# EAGLE design MONITOR_final_rev01 (EAGLE 9.6.0)
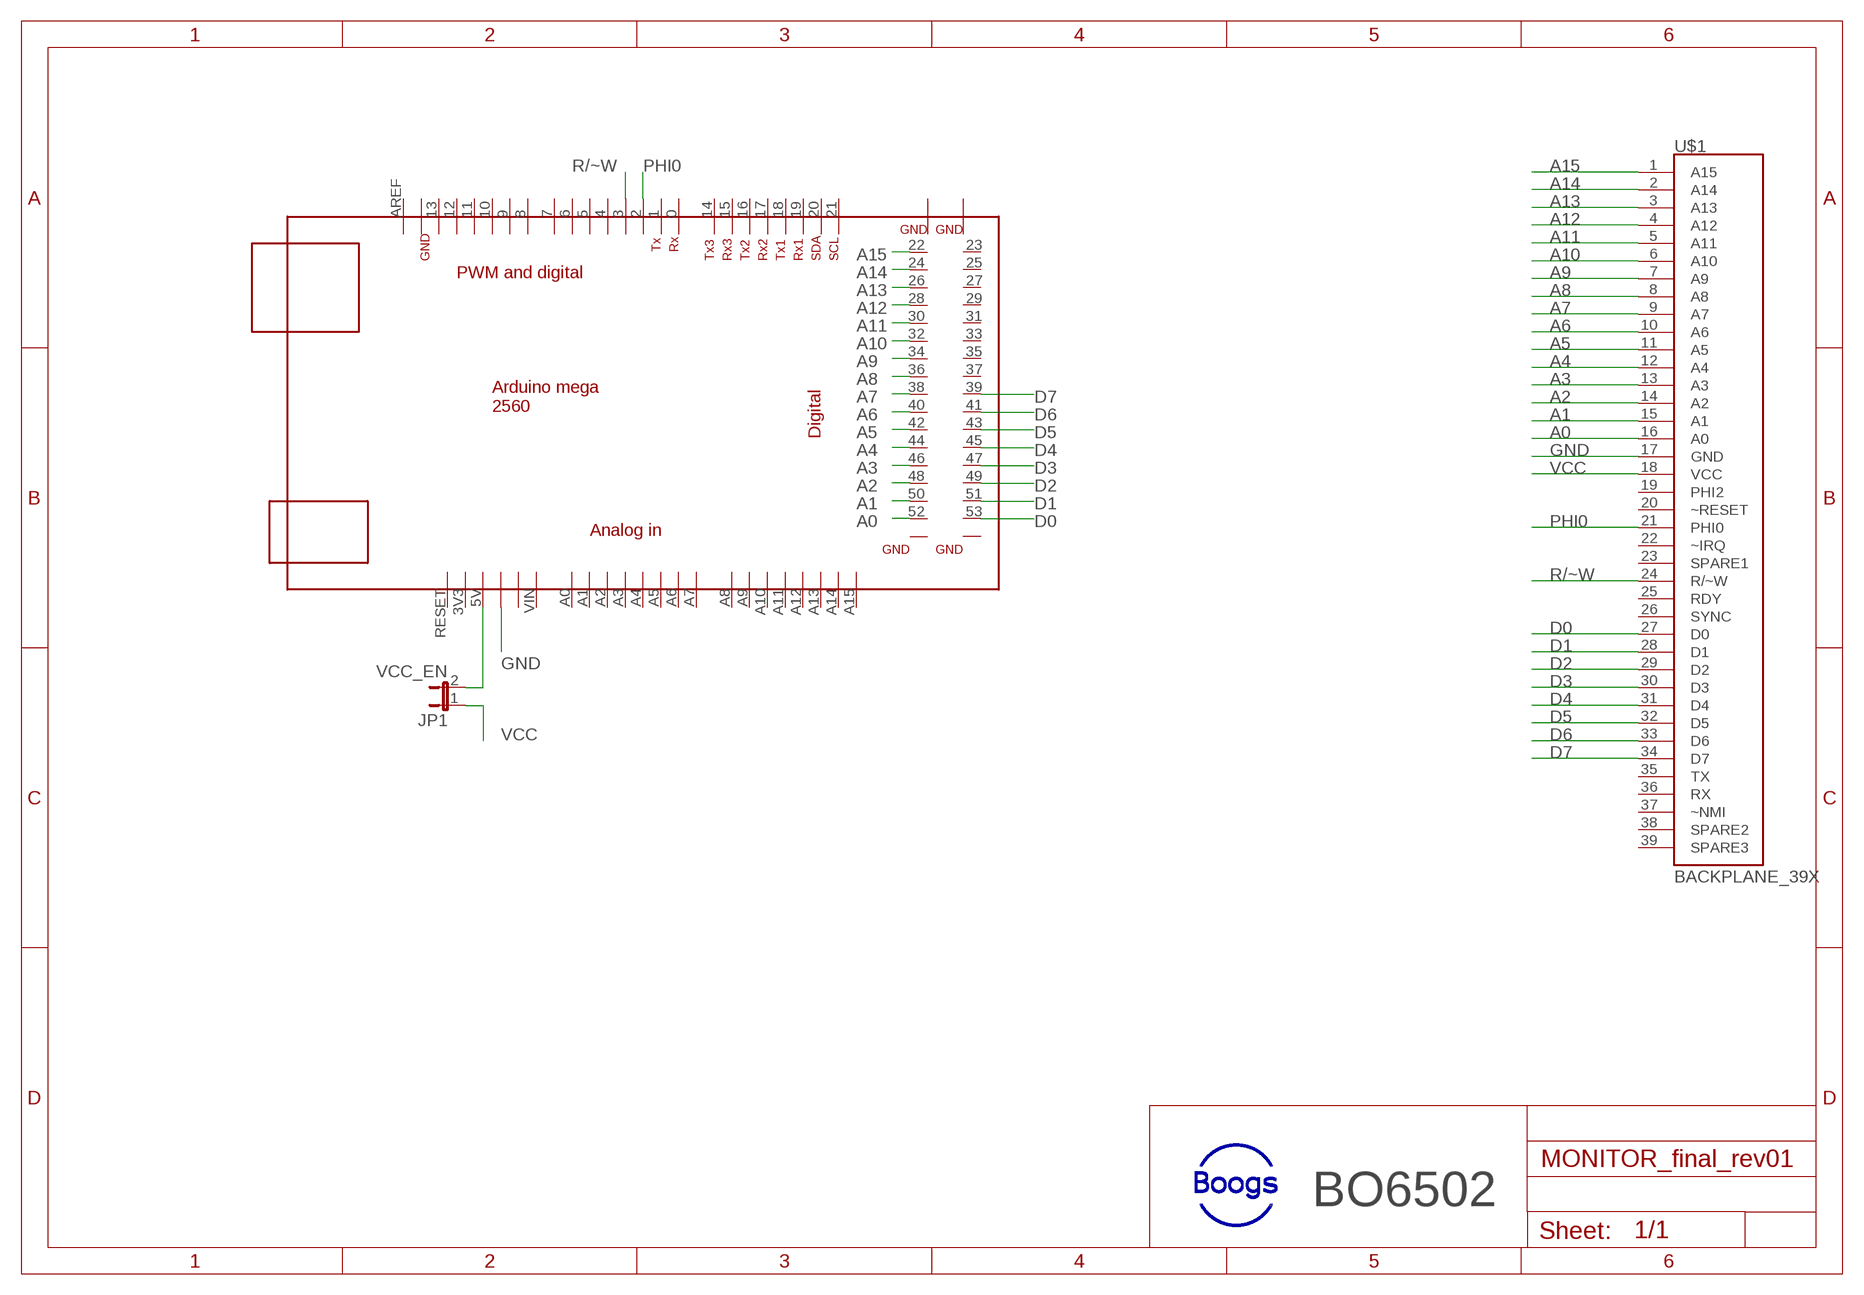
[diagram p0: schematic, sheet 1]

## Parts
JP1  VCC_EN  JP1E  [JP1]
U$1  BACKPLANE_39X  [BP_39X]
U$2  MEGA_DEVICE  [MEGAOUTLINE]

## Nets
A0: U$1.16(A0) U$2.52
A1: U$1.15(A1) U$2.50
A2: U$1.14(A2) U$2.48
A3: U$1.13(A3) U$2.46
A4: U$1.12(A4) U$2.44
A5: U$1.11(A5) U$2.42
A6: U$1.10(A6) U$2.40
A7: U$1.9(A7) U$2.38
A8: U$1.8(A8) U$2.36
A9: U$1.7(A9) U$2.34
A10: U$1.6(A10) U$2.32
A11: U$1.5(A11) U$2.30
A12: U$1.4(A12) U$2.28
A13: U$1.3(A13) U$2.26
A14: U$1.2(A14) U$2.24
A15: U$1.1(A15) U$2.22
D0: U$1.27(D0) U$2.53
D1: U$1.28(D1) U$2.51
D2: U$1.29(D2) U$2.49
D3: U$1.30(D3) U$2.47
D4: U$1.31(D4) U$2.45
D5: U$1.32(D5) U$2.43
D6: U$1.33(D6) U$2.41
D7: U$1.34(D7) U$2.39
GND: U$1.17(GND) U$2.GND@2(GND)
N$1: JP1.2 U$2.5V
PHI0: U$1.21(PHI0) U$2.2
R/~W: U$1.24(R/~W) U$2.3
VCC: JP1.1 U$1.18(VCC)
Unconnected: U$1.19(PHI2) U$1.20(~RESET) U$1.22(~IRQ) U$1.23(SPARE1) U$1.25(RDY) U$1.26(SYNC) U$1.35(TX) U$1.36(RX) U$1.37(~NMI) U$1.38(SPARE2) U$1.39(SPARE3) U$2.0 U$2.1 U$2.3V3 U$2.4 U$2.5 U$2.6 U$2.7 U$2.8 U$2.9 U$2.10 U$2.11 U$2.12 U$2.13 U$2.14 U$2.15 U$2.16 U$2.17 U$2.18 U$2.19 U$2.20 U$2.21 U$2.23 U$2.25 U$2.27 U$2.29 U$2.31 U$2.33 U$2.35 U$2.37 U$2.A0 U$2.A1 U$2.A2 U$2.A3 U$2.A4 U$2.A5 U$2.A6 U$2.A7 U$2.A8 U$2.A9 U$2.A10 U$2.A11 U$2.A12 U$2.A13 U$2.A14 U$2.A15 U$2.AREF U$2.GND@1(GND) U$2.GND@3(GND) U$2.GND@4(GND) U$2.GND@5(GND) U$2.GND@6(GND) U$2.GND@7(GND) U$2.RESET U$2.VIN

## Notes on the sheet
- BO6502

## Library data of the parts
JP1 = jumper:JP1E: JUMPER
U$1 = 65xx_family:BACKPLANE_39X; A15: A15
U$2 = ArduinoMegaOutline:MEGA_DEVICE: mega card as device

## Board
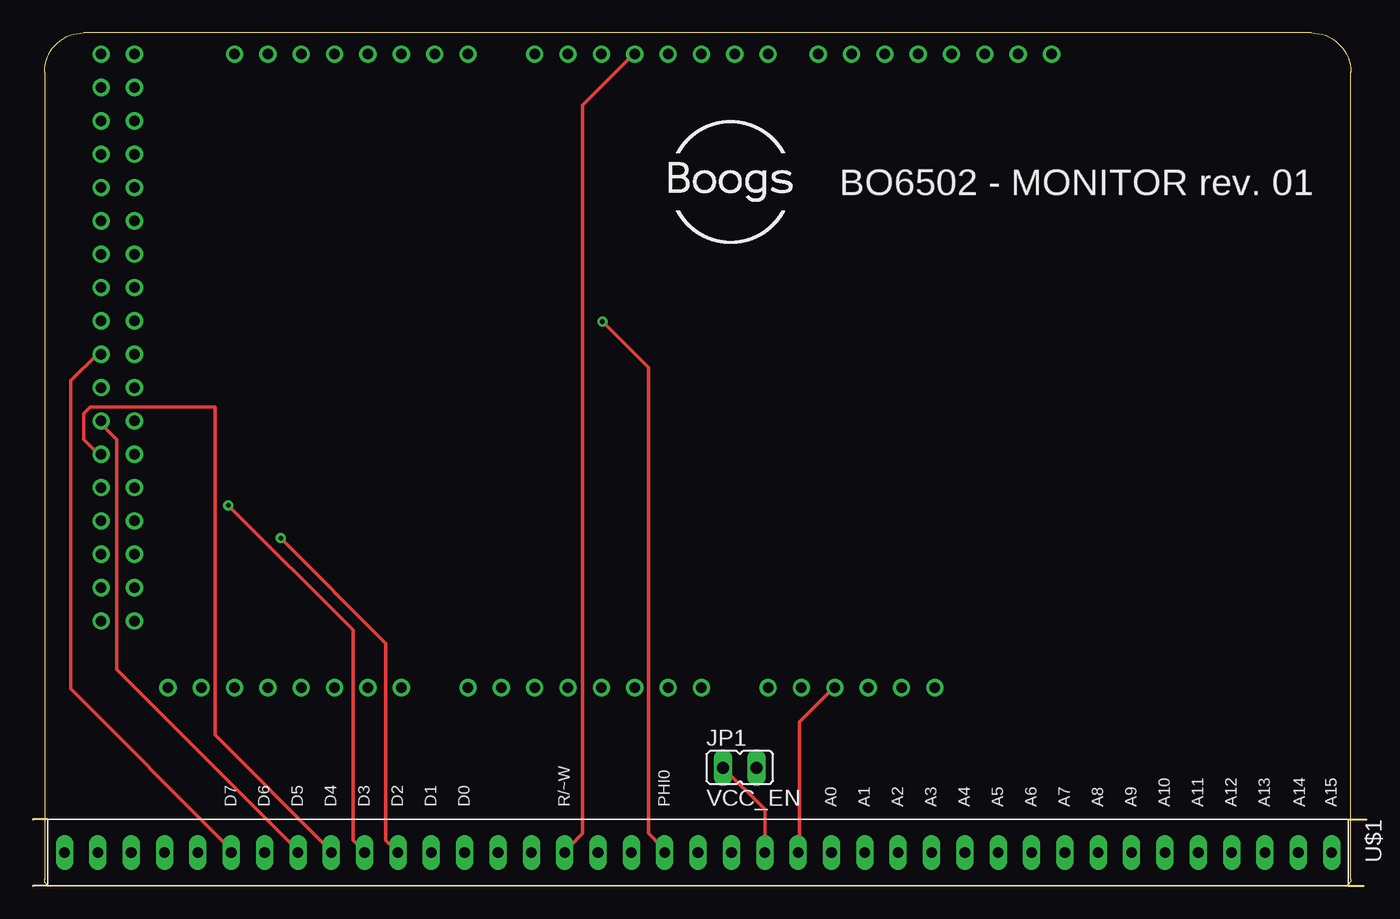
[diagram p1: board, top side]
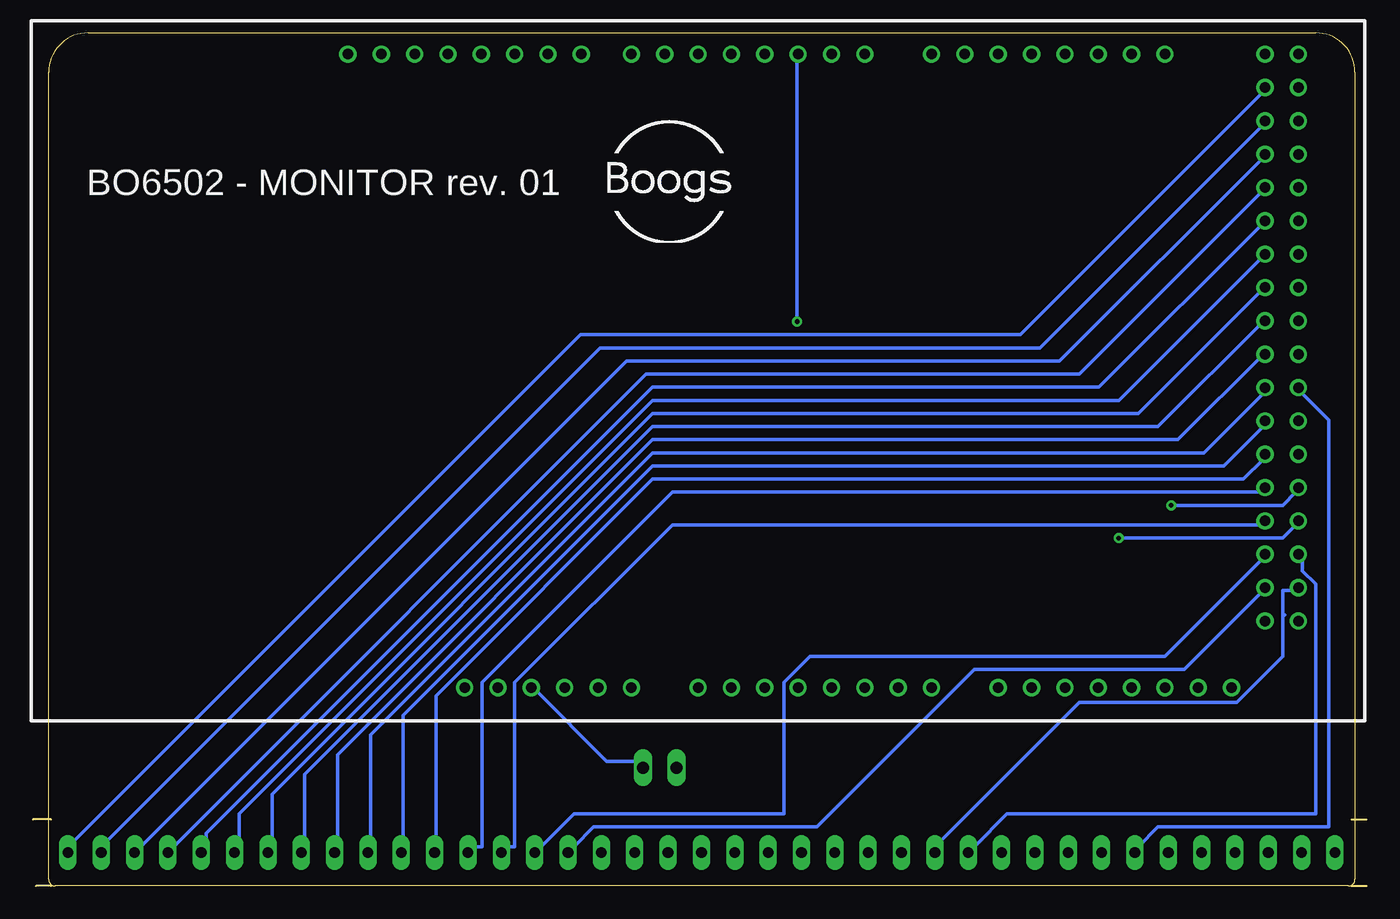
[diagram p2: board, bottom side, seen from below]

Size 101.6 x 65 mm. Coordinates in mm from the lower left corner, seen from the top.
Outline: 1.14,5.08 0,5.08
Outline: 1.14,0 0,0
Outline: 100.2,5.08 101.6,5.08
Outline: 100.2,0 101.35,0
Outline: 1.39,0 99.89,0 arc90 100.39,0.5 100.39,62 arc90 97.39,65 3.89,65 arc90 0.89,62 0.89,0.5 arc90 1.39,0
Copper layers (1*16): Top 0.035mm / dielectric 1.5mm / Bottom 0.035mm
Design rules "default *": minimum track width 10mil, minimum drill 0.35mm, track to track 10mil, track to pad 10mil, pad to pad 10mil, via to via 10mil, smd to smd 6mil, copper to edge 40mil, drill to drill 6mil, minimum pad ring 10mil, minimum via ring 8mil, stop-mask expansion 4mil, vias tented up to drill 15mil, thermal gap 10mil

### Footprints (pad centres in the part's own frame; a part is rotated, then mirrored left to right if it is on the bottom)
JP1 = drill 0.914 long: 1 0,-1.27; 2 0,1.27
BP_39X = drill 0.813 long: 1 1.27,59.69; 2 1.27,57.15; 3 1.27,54.61; 4 1.27,52.07; 5 1.27,49.53; 6 1.27,46.99; 7 1.27,44.45; 8 1.27,41.91; 9 1.27,39.37; 10 1.27,36.83; 11 1.27,34.29; 12 1.27,31.75; 13 1.27,29.21; 14 1.27,26.67; 15 1.27,24.13; 16 1.27,21.59; 17 1.27,19.05; 18 1.27,16.51; 19 1.27,13.97; 20 1.27,11.43; 21 1.27,8.89; 22 1.27,6.35; 23 1.27,3.81; 24 1.27,1.27; 25 1.27,-1.27; 26 1.27,-3.81; 27 1.27,-6.35; 28 1.27,-8.89; 29 1.27,-11.43; 30 1.27,-13.97; 31 1.27,-16.51; 32 1.27,-19.05; 33 1.27,-21.59; 34 1.27,-24.13; 35 1.27,-26.67; 36 1.27,-29.21; 37 1.27,-31.75; 38 1.27,-34.29; 39 1.27,-36.83
MEGAOUTLINE = drill 0.8: 0 12.7,24.13; 1 10.16,24.13; 2 7.62,24.13; 3 5.08,24.13; 3V3 -15.24,-24.13; 4 2.54,24.13; 5 0,24.13; 5V -12.7,-24.13; 6 -2.54,24.13; 7 -5.08,24.13; 8 -8.89,24.13; 9 -11.43,24.13; 10 -13.97,24.13; 11 -16.51,24.13; 12 -19.05,24.13; 13 -21.59,24.13; 14 17.78,24.13; 15 20.32,24.13; 16 22.86,24.13; 17 25.4,24.13; 18 27.94,24.13; 19 30.48,24.13; 20 33.02,24.13; 21 35.56,24.13; 22 43.18,21.59; 23 45.72,21.59; 24 43.18,19.05; 25 45.72,19.05; 26 43.18,16.51; 27 45.72,16.51; 28 43.18,13.97; 29 45.72,13.97; 30 43.18,11.43; 31 45.72,11.43; 32 43.18,8.89; 33 45.72,8.89; 34 43.18,6.35; 35 45.72,6.35; 36 43.18,3.81; 37 45.72,3.81; 38 43.18,1.27; 39 45.72,1.27; 40 43.18,-1.27; 41 45.72,-1.27; 42 43.18,-3.81; 43 45.72,-3.81; 44 43.18,-6.35; 45 45.72,-6.35; 46 43.18,-8.89; 47 45.72,-8.89; 48 43.18,-11.43; 49 45.72,-11.43; 50 43.18,-13.97; 51 45.72,-13.97; 52 43.18,-16.51; 53 45.72,-16.51; A0 0,-24.13; A1 2.54,-24.13; A2 5.08,-24.13; A3 7.62,-24.13; A4 10.16,-24.13; A5 12.7,-24.13; A6 15.24,-24.13; A7 17.78,-24.13; A8 22.86,-24.13; A9 25.4,-24.13; A10 27.94,-24.13; A11 30.48,-24.13; A12 33.02,-24.13; A13 35.56,-24.13; A14 38.1,-24.13; A15 40.64,-24.13; AREF -26.67,24.13; GND@1 -24.13,24.13; GND@2 -10.16,-24.13; GND@3 -7.62,-24.13; GND@4 43.18,24.13; GND@5 45.72,24.13; GND@6 43.18,-19.05; GND@7 45.72,-19.05; RESET -17.78,-24.13; VIN -5.08,-24.13

### Placement (x,y rotation side)
JP1  53.85,9.02 270 top
U$1  39.24,3.81 270 top
U$2  50.93,39.24 0 bottom

### Tracks (layer width: path | path; a pad name or v marks a point on that pad's centre or on a via)
A0
  Bottom 0.254: U$2.52 7.89,22.5 13.89,16.5 29.89,16.5 41.89,4.5 58.89,4.5 60.39,3 U$1.16
A1
  Bottom 0.254: U$2.50 7.89,25 15.39,17.5 42.39,17.5 44.39,15.5 44.39,5.5 60.39,5.5 62.89,3 U$1.15
A2
  Bottom 0.254: U$2.48 7.89,27.5 52.89,27.5 64.89,15.5 64.89,3 65.89,3 U$1.14
A3
  Bottom 0.254: U$2.46 7.89,30 52.89,30 67.39,15.5 67.39,3 68.39,3 U$1.13
A4
  Bottom 0.254: U$2.44 7.89,32.5 9.39,31 54.39,31 70.89,14.5 70.89,3 U$1.12
A5
  Bottom 0.254: U$2.42 7.89,35 10.89,32 54.39,32 73.39,13 73.39,3 U$1.11
A6
  Bottom 0.254: U$2.40 7.89,37.5 12.39,33 54.39,33 75.89,11.5 75.89,3 U$1.10
A7
  Bottom 0.254: U$2.38 7.89,40.5 14.39,34 54.39,34 78.39,10 78.39,3 U$1.9
A8
  Bottom 0.254: U$2.36 7.89,43 15.89,35 54.39,35 80.89,8.5 80.89,3 U$1.8
A9
  Bottom 0.254: U$2.34 7.89,45.5 17.39,36 54.39,36 83.39,7 83.39,3 U$1.7
A10
  Bottom 0.254: U$2.32 7.89,48 18.89,37 54.39,37 85.89,5.5 85.89,3 U$1.6
A11
  Bottom 0.254: U$2.30 7.89,50.5 20.39,38 54.39,38 88.39,4 88.39,3 U$1.5
A12
  Bottom 0.254: U$2.28 7.89,53 21.89,39 54.89,39 90.89,3 U$1.4
A13
  Bottom 0.254: U$2.26 7.89,55.5 23.39,40 56.39,40 93.39,3 U$1.3
A14
  Bottom 0.254: U$2.24 7.89,58 24.89,41 58.39,41 96.39,3 U$1.2
A15
  Bottom 0.254: U$2.22 7.89,60.5 26.39,42 59.89,42 98.89,3 U$1.1
D0
  Bottom 0.254: 6.39,20.5 6.25,20.64 | 6.39,20.5 6.39,22.5 5.39,22.5 U$2.53 | 6.39,20.5 6.39,17.5 9.89,14 21.89,14 32.89,3 U$1.27
D1
  Bottom 0.254: U$2.51 4.89,25 4.89,24 3.89,23 3.89,5.5 27.39,5.5 29.89,3 U$1.28
D2  (via drill 0.35)
  Top 0.254: v18.89,26.5 26.89,18.5 26.89,3.5 27.39,3 U$1.29
  Bottom 0.254: v18.89,26.5 6.39,26.5 5.39,27.5 U$2.49
D3  (via drill 0.35)
  Top 0.254: v14.89,29 24.39,19.5 24.39,3.5 24.89,3 U$1.30
  Bottom 0.254: v14.89,29 6.39,29 5.39,30 U$2.47
D4
  Top 0.254: U$2.45 4.89,33 3.89,34 3.89,36 4.39,36.5 13.89,36.5 13.89,11.5 22.39,3 U$1.31
D5
  Top 0.254: U$2.43 5.39,35 6.39,34 6.39,16.5 19.89,3 U$1.32
D6
  Bottom 0.254: U$2.41 4.89,37.5 2.89,35.5 2.89,4.5 15.89,4.5 17.39,3 U$1.33
D7
  Top 0.254: U$2.39 4.89,40.5 2.89,38.5 2.89,15 14.89,3 U$1.34
GND
  Top 0.254: U$2.GND@2 60.89,15 58.39,12.5 58.39,3 U$1.17
N$1
  Bottom 0.254: U$2.5V 63.39,15 57.89,9.5 55.53,9.5 JP1.2
PHI0  (via drill 0.35)
  Top 0.254: v43.39,43 46.89,39.5 46.89,4 47.89,3 U$1.21
  Bottom 0.254: v43.39,43 43.39,63 U$2.2
R/~W
  Top 0.254: U$2.3 45.39,63 41.89,59.5 41.89,4 40.89,3 U$1.24
VCC
  Top 0.254: 55.72,2.54 U$1.18 55.75,5.84 JP1.1

### Text on the board
tNames: BO6502 - MONITOR rev. 01 | D7 | D6 | D5 | D4 | D3 | D2 | D1 | D0 | R/~W | PHI0 | A0 | A1 | A2 | A3 | A4 | A5 | A6 | A7 | A8 | A9 | A10 | A11 | A12 | A13 | A14 | A15
bNames: BO6502 - MONITOR rev. 01